# Altium project TS_24 PDM_2.PrjPcb
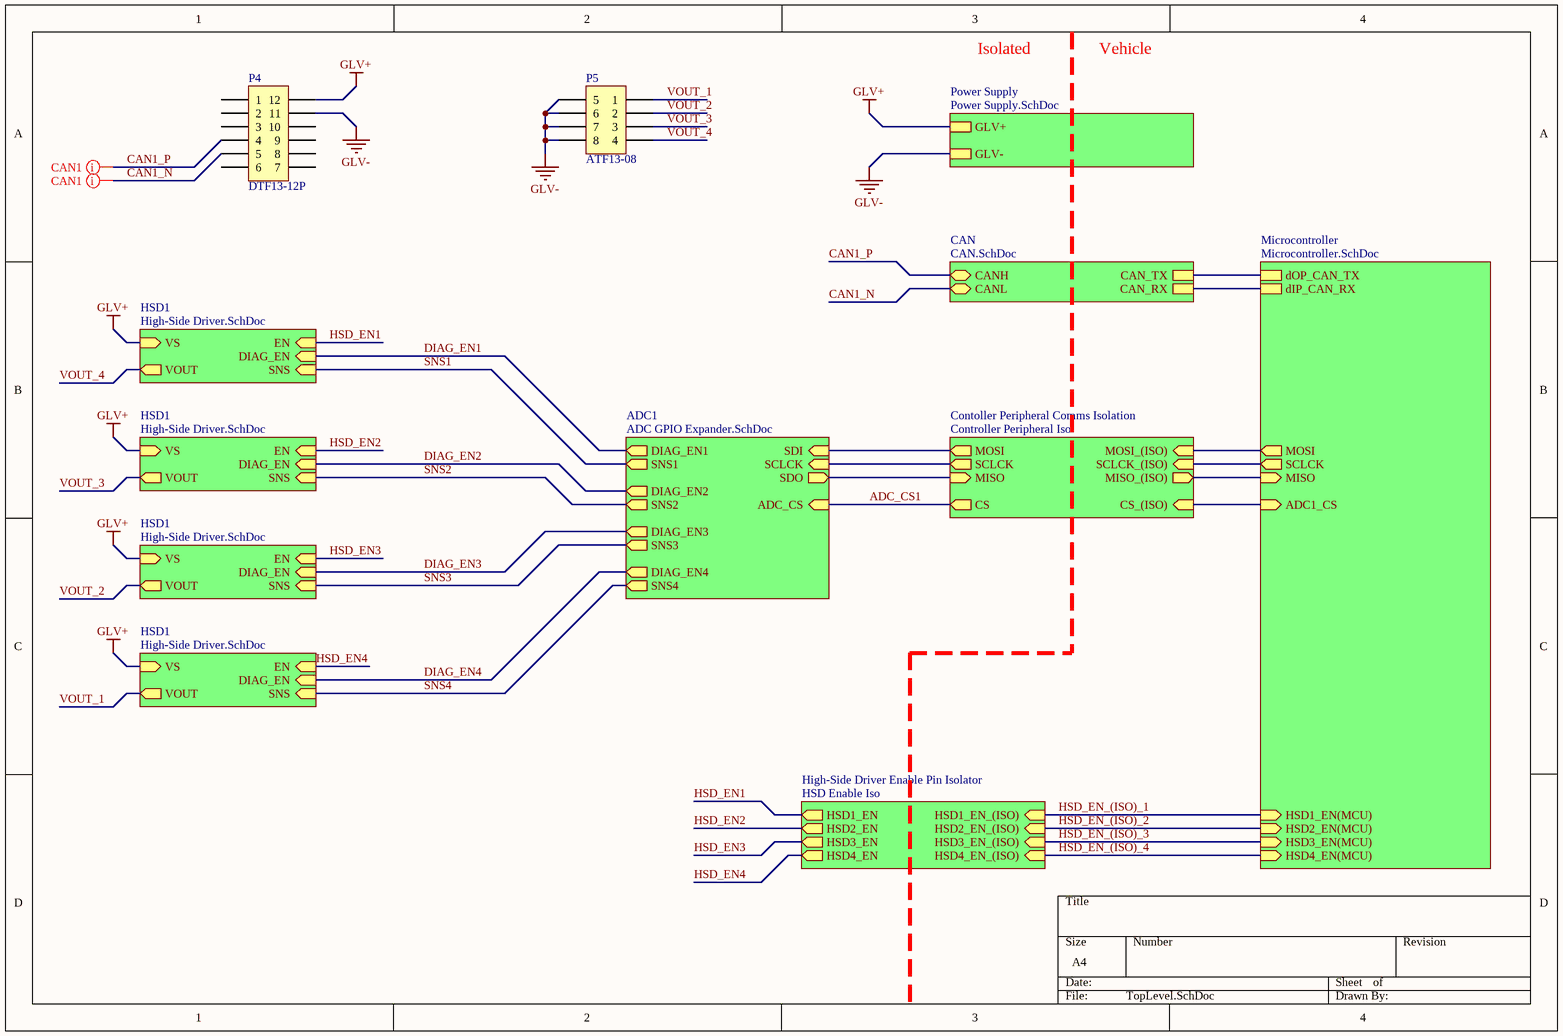
[diagram p0: TopLevel.SchDoc]
6 sheets, 108 parts. Net scope: hierarchical (ports join the sheet entries above them; power ports are global).
Board file: PCB.PcbDoc
Sheets:
  TopLevel.SchDoc
    Power Supply = Power Supply.SchDoc
    Contoller Peripheral Comms Isolation = Controller Peripheral Iso.SchDoc
    Microcontroller = Microcontroller.SchDoc
    HSD1 = High-Side Driver.SchDoc
    HSD1 = High-Side Driver.SchDoc
    HSD1 = High-Side Driver.SchDoc
    HSD1 = High-Side Driver.SchDoc
    ADC1 = ADC GPIO Expander.SchDoc

## Sheet TopLevel.SchDoc
size A4; SheetNumber: 1; SheetTotal: 8

### Parts
P4  DTF13-12P  [DTF13-12P]
P5  ATF13-08  [ATF13-08]

### Sub-sheets
ADC1 = ADC GPIO Expander.SchDoc: SDO (out), SCLCK (in), SDI (in), ADC_CS (in), DIAG_EN1 (out), SNS1 (out), DIAG_EN2 (out), SNS2 (out), DIAG_EN3 (out), SNS3 (out), DIAG_EN4 (out), SNS4 (out)
CAN = CAN.SchDoc (file not in this document): CANH (bidir), CANL (bidir), CAN_TX, CAN_RX
Contoller Peripheral Comms Isolation = Controller Peripheral Iso: MOSI (out), SCLCK (out), MISO (in), MOSI_(ISO) (in), MISO_(ISO) (out), SCLCK_(ISO) (in), CS (out), CS_(ISO) (in)
High-Side Driver Enable Pin Isolator = HSD Enable Iso (file not in this document): HSD1_EN (out), HSD2_EN (out), HSD3_EN (out), HSD1_EN_(ISO) (in), HSD3_EN_(ISO) (in), HSD2_EN_(ISO) (in), HSD4_EN (out), HSD4_EN_(ISO) (in)
HSD1 = High-Side Driver.SchDoc: VS (in), EN (in), DIAG_EN (in), SNS (in), VOUT (out)
HSD1 = High-Side Driver.SchDoc: VS (in), EN (in), DIAG_EN (in), SNS (in), VOUT (out)
HSD1 = High-Side Driver.SchDoc: VS (in), EN (in), DIAG_EN (in), SNS (in), VOUT (out)
HSD1 = High-Side Driver.SchDoc: VS (in), EN (in), DIAG_EN (in), SNS (in), VOUT (out)
Microcontroller = Microcontroller.SchDoc: dOP_CAN_TX, dIP_CAN_RX, MOSI (out), MISO (in), SCLCK (out), HSD1_EN(MCU) (in), HSD2_EN(MCU) (in), HSD3_EN(MCU) (in), HSD4_EN(MCU) (in), ADC1_CS (in)
Power Supply = Power Supply.SchDoc: GLV+, GLV-

### Nets
GLV+: P4.12 ; sheet Power Supply/GLV+, sheet HSD1/VS, sheet HSD1/VS, sheet HSD1/VS, sheet HSD1/VS
GLV-: P4.11 P5.5 P5.6 P5.7 P5.8 ; sheet Power Supply/GLV-
ADC_CS1: sheet Contoller Peripheral Comms Isolation/CS, sheet ADC1/ADC_CS  [project net ADC_CS]
CAN1_N: P4.5 ; sheet CAN/CANL
CAN1_P: P4.4 ; sheet CAN/CANH
DIAG_EN1: sheet HSD1/DIAG_EN, sheet ADC1/DIAG_EN1
DIAG_EN2: sheet HSD1/DIAG_EN, sheet ADC1/DIAG_EN2
DIAG_EN3: sheet HSD1/DIAG_EN, sheet ADC1/DIAG_EN3
DIAG_EN4: sheet HSD1/DIAG_EN, sheet ADC1/DIAG_EN4
HSD_EN1: sheet High-Side Driver Enable Pin Isolator/HSD1_EN, sheet HSD1/EN
HSD_EN2: sheet High-Side Driver Enable Pin Isolator/HSD2_EN, sheet HSD1/EN
HSD_EN3: sheet High-Side Driver Enable Pin Isolator/HSD3_EN, sheet HSD1/EN
HSD_EN4: sheet High-Side Driver Enable Pin Isolator/HSD4_EN, sheet HSD1/EN
HSD_EN_(ISO)_1: sheet High-Side Driver Enable Pin Isolator/HSD1_EN_(ISO), sheet Microcontroller/HSD1_EN(MCU)
HSD_EN_(ISO)_2: sheet High-Side Driver Enable Pin Isolator/HSD2_EN_(ISO), sheet Microcontroller/HSD2_EN(MCU)
HSD_EN_(ISO)_3: sheet High-Side Driver Enable Pin Isolator/HSD3_EN_(ISO), sheet Microcontroller/HSD3_EN(MCU)
HSD_EN_(ISO)_4: sheet High-Side Driver Enable Pin Isolator/HSD4_EN_(ISO), sheet Microcontroller/HSD4_EN(MCU)
SCLCK: sheet Contoller Peripheral Comms Isolation/SCLCK, sheet ADC1/SCLCK
SDI: sheet Contoller Peripheral Comms Isolation/MOSI, sheet ADC1/SDI
SDO: sheet Contoller Peripheral Comms Isolation/MISO, sheet ADC1/SDO
SNS1: sheet HSD1/SNS, sheet ADC1/SNS1
SNS2: sheet HSD1/SNS, sheet ADC1/SNS2
SNS3: sheet HSD1/SNS, sheet ADC1/SNS3
SNS4: sheet HSD1/SNS, sheet ADC1/SNS4
VOUT_1: P5.1 ; sheet HSD1/VOUT
VOUT_2: P5.2 ; sheet HSD1/VOUT
VOUT_3: P5.3 ; sheet HSD1/VOUT
VOUT_4: P5.4 ; sheet HSD1/VOUT
NetISO1_3: sheet Contoller Peripheral Comms Isolation/CS_(ISO), sheet Microcontroller/ADC1_CS
NetISO1_4: sheet Contoller Peripheral Comms Isolation/MISO_(ISO), sheet Microcontroller/MISO
NetISO1_5: sheet Contoller Peripheral Comms Isolation/SCLCK_(ISO), sheet Microcontroller/SCLCK
NetISO1_6: sheet Contoller Peripheral Comms Isolation/MOSI_(ISO), sheet Microcontroller/MOSI
NetR12_1: sheet CAN/CAN_RX, sheet Microcontroller/dIP_CAN_RX
NetR13_1: sheet CAN/CAN_TX, sheet Microcontroller/dOP_CAN_TX

Not connected (* = marked no-connect by the designer): P4 1 2 3 6 7 8 9 10

### Layout directives
differential pair: CAN1_N, CAN1_P

### Notes on the sheet
- Isolated
- Vehicle

### Library data of the parts
P4 = DTF13-12P: Positions: 12; Pitch: 4.45mm; Angle: 90; Flange: No; Contact: Copper Alloy; Part Number: DTF13-12P; Row Spacing: 4.45mm; Digikey Part Number: 1734-1861-ND; Digikey Link: https://www.digikey.com/products/en?keywords=dtf13-12pa
P5 = ATF13-08: Part Number: ATF13-08

## Sheet Power Supply.SchDoc
size A4; SheetNumber: 8; SheetTotal: 8
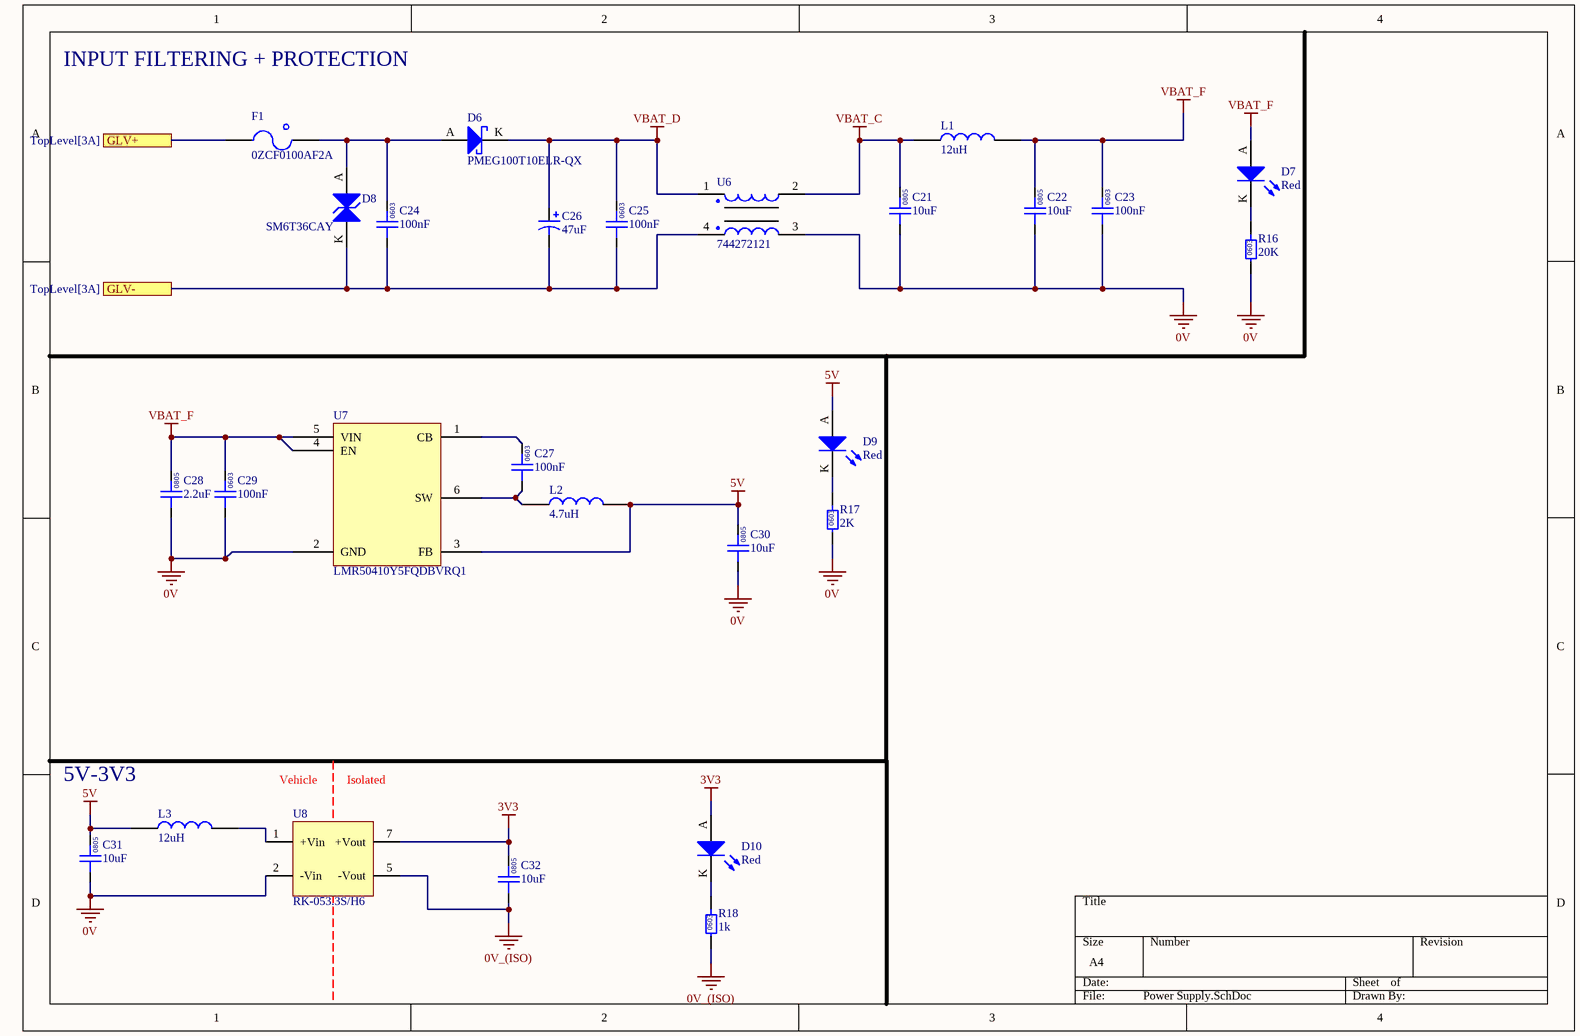
[diagram p1: Power Supply.SchDoc]

### Parts
C21  10uF  [0805]
C22  10uF  [0805]
C23  100nF  [0603]
C24  100nF  [0603]
C25  100nF  [0603]
C26  47uF  [CHEMI-CON ELCO]
C27  100nF  [0603]
C28  2.2uF  [0805]
C29  100nF  [0603]
C30  10uF  [0805]
C31  10uF  [0805]
C32  10uF  [0805]
D6  PMEG100T10ELR-QX  [NXP SOD123W]
D7  Red  [0805 LED]
D8  SM6T36CAY  [ST SMB DIODE]
D9  Red  [0805 LED]
D10  Red  [0805 LED]
F1  0ZCF0100AF2A  [2920]
L1  12uH  [1812]
L2  4.7uH  [SRN3015TA-4R7M]
L3  12uH  [1812]
R16  20K  [0603]
R17  2K  [0603]
R18  1k  [0603]
U6  744272121  [Wurth 4-PC Pad]
U7  LMR50410Y5FQDBVRQ1  [TI-SOT23-6]
U8  RK-053.3S/H6  [RK-053.3S/H6]

### Ports
GLV+ (see TopLevel[3A]), GLV- (see TopLevel[3A])

### Nets
0V: C21.1 C22.1 C23.1 C28.1 C29.1 C30.1 C31.1 R16.1 R17.1 U6.3 U7.2(GND) U8.2(-Vin)
0V_(ISO): C32.1 R18.1 U8.5(-Vout)
3V3: C32.2 D10.A U8.7(+Vout)
5V: C30.2 C31.2 D9.A L2.1 L3.2 U7.3(FB)
GLV+: F1.1 ; port GLV+
GLV-: C24.1 C25.1 C26.1 D8.K U6.4 ; port GLV-
VBAT_C: C21.2 L1.2 U6.2
VBAT_D: C25.2 C26.2 D6.K U6.1
VBAT_F: C22.2 C23.2 C28.2 C29.2 D7.A L1.1 U7.4(EN) U7.5(VIN)
NetC24_2: C24.2 D6.A D8.A F1.2
NetC27_1: C27.1 L2.2 U7.6(SW)
NetC27_2: C27.2 U7.1(CB)
NetD7_K: D7.K R16.2
NetD9_K: D9.K R17.2
NetD10_K: D10.K R18.2
NetL3_1: L3.1 U8.1(+Vin)

### Notes on the sheet
- INPUT FILTERING + PROTECTION
- 5V-3V3
- Vehicle
- Isolated
- (in symbol GCM188L81H104KA57D) 0603
- (in symbol GRM21BR6YA106KE43L) 0805
- (in symbol GRM21BR71E225KE11L) 0805
- (in symbol RC0603FR-071KL) 0603
- (in symbol RC0603FR-072KL) 0603
- (in symbol RC0603FR-0720KL) 0603

### Library data of the parts
C21 C22 C30-C32 = GRM21BR6YA106KE43L: Manufacturer: muRata; Rated Voltage: 50V; Tolerance: 10%; Material: MLCC; Temperature Rating: X5R; Part Number: GRM21BR6YA106KE43L; Value: 10uF; Digikey Part Number: 490-10514-6-ND
C23-C25 C27 C29 = GCM188L81H104KA57D: Manufacturer: muRata; Rated Voltage: 50V; Tolerance: ±10%; Material: MLCC; Temperature Rating: X8L; Part Number: GCM188L81H104KA57D; Value: 100nF; Digikey Part Number: 490-6049-1-ND
C26 = HHXA350ARA470MF61G: Part Number: HHXA350ARA470MF61G
C28 = GRM21BR71E225KE11L: Manufacturer: Murata Electronics; Rated Voltage: 25V; Tolerance: ±10%; Material: MLCC; Temperature Rating: X7R; Part Number: GRM21BR71E225KE11L; Value: 2.2uF; Digikey Part Number: 490-14467-2-ND
D6 = PMEG100T10ELR-QX: Manufacturer: Nexperia USA Inc.; Forward Voltage: 0.75 V @ 1A; Breakdown Voltage: 100 V; Rated Power: 680 mW; Part Number: PMEG100T10ELR-QX; Digikey Part Number: 1727-PMEG100T10ELR-QXCT-ND
D7 D9 D10 = SML-210LTT86: Red LED Indication - Discrete 1.75V 0805 (2012 Metric); Manufacturer: ROHM Semiconductor; Part Number: SML-210LTT86; Colour: Red; Digikey Part Number: 511-1286-1-ND
D8 = SM6T36CAY: Manufacturer: STMicroelectronics; Forward Voltage: 30.8 V; Rated Power: 600W; Part Number: SM6T36CAY; Breakdown Voltage: 30.8 V; Digikey Part Number: 497-10804-1-ND
F1 = 0ZCF0100AF2A: PTC RESET FUSE 60V 1A 292; Manufacturer: Littelfuse Inc.; Part Number: 0ZCF0100AF2A; Digikey Part Number: 507-2070-1-ND; Digikey Link: https://www.digikey.com/product-detail/en/bel-fuse-inc/0ZCF0100AF2A/507-2070-1-ND/6210547
L1 L3 = RLS-126: Manufacturer: Recom; Tolerance: 0.2; Impedance: 230mOhm; Rated Current: 0.8 A; Material: Wirewound; Part Number: RLS-126; Value: 12uH; Digikey Part Number: 945-3429-ND
L2 = SRN4018-4R7M: Manufacturer: Bourns; Tolerance: 0.2; Impedance: 84mOhms; Rated Current: 1.9A; Material: Wirewound; Part Number: SRN4018-4R7M; Value: 4.7uH; Digikey Part Number: SRN3015TA-4R7MCT-ND
R16 = RC0603FR-0720KL: Manufacturer: YAGEO; Tolerance: 0.01; Rated Power: 0.1W; Part Number: RC0603FR-0720KL; Value: 20K; Digikey Part Number: 311-20.0KHRCT-ND; Material: FR-07
R17 = RC0603FR-072KL: Manufacturer: YAGEO; Tolerance: 0.01; Rated Power: 0.1W; Part Number: RC0603FR-072KL; Value: 2K; Digikey Part Number: 311-2.00KHRCT-ND; Material: FR-07
R18 = RC0603FR-071KL: Manufacturer: YAGEO; Tolerance: 0.01; Rated Power: 0.1W; Part Number: RC0603FR-071KL; Value: 1k; Digikey Part Number: 311-1.00KHRCT-ND; Material: FR-07
U6 = 744272121: Manufacturer: Wurth Electronics Inc; Value: 120uH @ 100kHz; Impedance: 460 Ohms @ 30MHz; Rated Current: 2.5 A; Part Number: 744272121; Material: Wirewound; Digikey Part Number: 732-1489-1-ND
U7 = LMR50410-Q1: IC REG BUCK 5V 1A SOT23-6; Manufacturer: Texas Instruments; Input Voltage: 4-36V; Part Number: LMR50410-Q1; Output Voltage: 5V; Output Current: 1A; Digikey Part Number: 296-LMR50410Y5FQDBVRQ1CT-ND
U8 = RK-053.3S/H6: DC DC CONVERTER 3.3V 1W; Manufacturer: Recom; Input Voltage: 5V; Output Current: 303mA; Part Number: RK-053.3S/H6; Output Voltage: 3.3V

## Sheet Controller Peripheral Iso.SchDoc
size A4; SheetNumber: 4; SheetTotal: 8
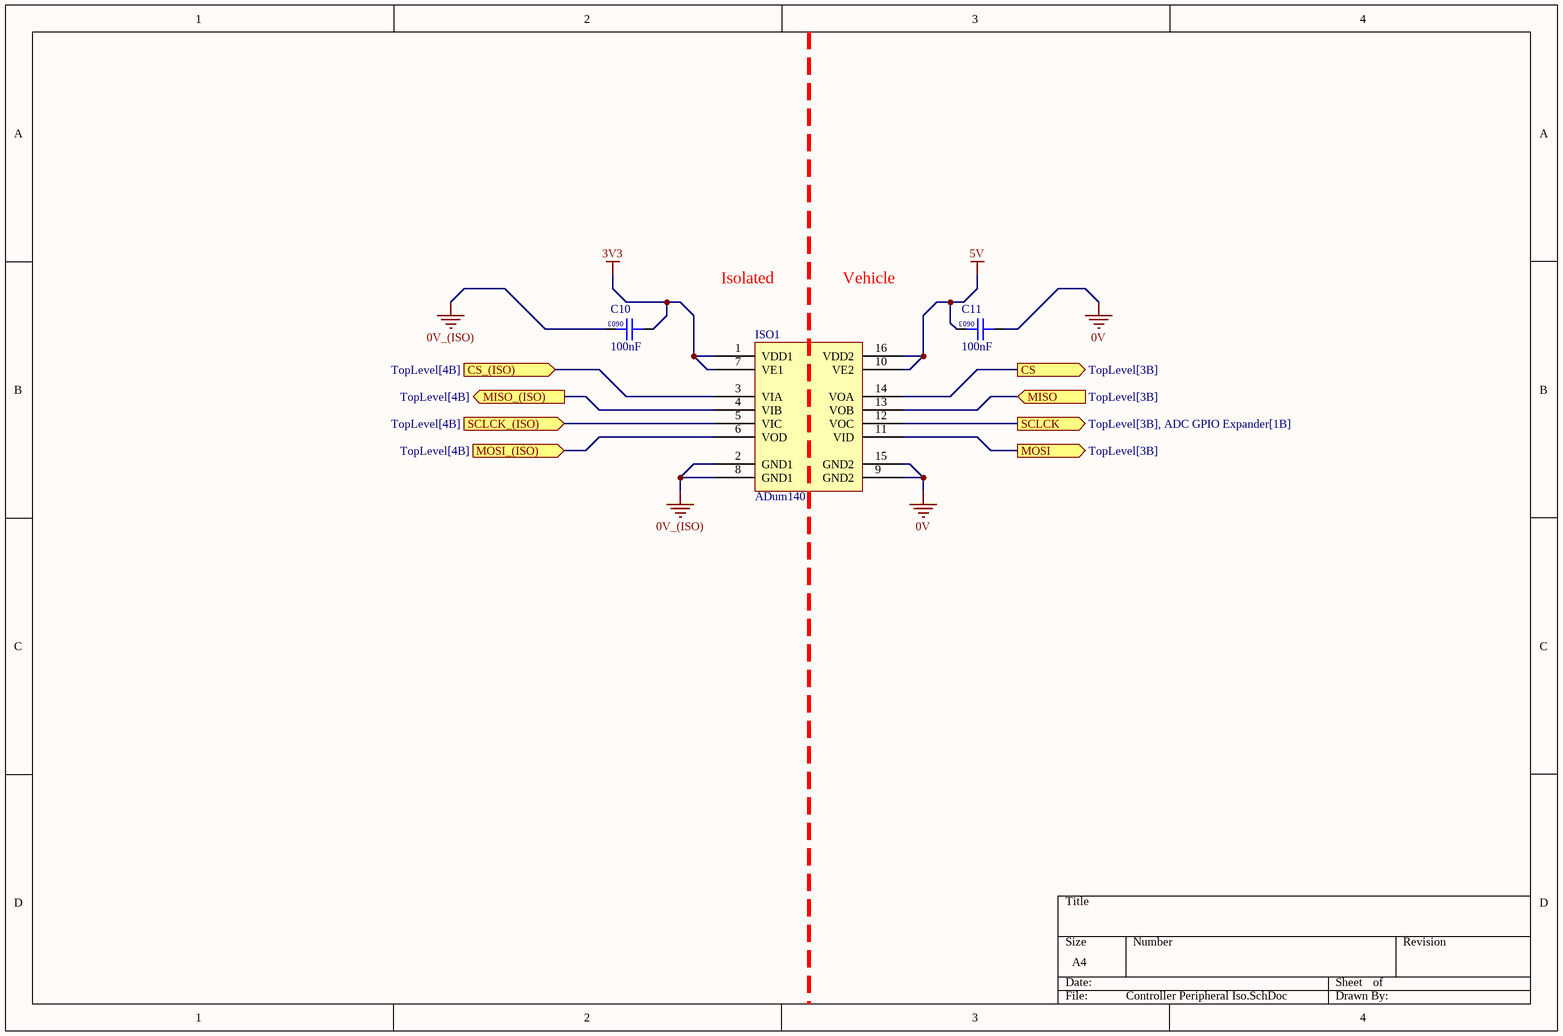
[diagram p2: Controller Peripheral Iso.SchDoc]

### Parts
C10  100nF  [0603]
C11  100nF  [0603]
ISO1  ADum1401  [AD 16-SOIC]

### Ports
CS (out, see TopLevel[3B]), CS_(ISO) (in, see TopLevel[4B]), MISO (in, see TopLevel[3B]), MISO_(ISO) (out, see TopLevel[4B]), MOSI (out, see TopLevel[3B]), MOSI_(ISO) (in, see TopLevel[4B]), SCLCK (out, see TopLevel[3B], ADC GPIO Expander[1B]), SCLCK_(ISO) (in, see TopLevel[4B])

### Nets
0V: C11.1 ISO1.9(GND2) ISO1.15(GND2)
0V_(ISO): C10.2 ISO1.2(GND1) ISO1.8(GND1)
3V3: C10.1 ISO1.1(VDD1) ISO1.7(VE1)
5V: C11.2 ISO1.10(VE2) ISO1.16(VDD2)
ADC_CS: ISO1.14(VOA) ; port CS
SCLCK: ISO1.12(VOC) ; port SCLCK
SDI: ISO1.11(VID) ; port MOSI
SDO: ISO1.13(VOB) ; port MISO
NetISO1_3: ISO1.3(VIA) ; port CS_(ISO)
NetISO1_4: ISO1.4(VIB) ; port MISO_(ISO)
NetISO1_5: ISO1.5(VIC) ; port SCLCK_(ISO)
NetISO1_6: ISO1.6(VOD) ; port MOSI_(ISO)

### Notes on the sheet
- Isolated
- Vehicle
- (in symbol GCM188L81H104KA57D) 0603

### Library data of the parts
C10 C11 = GCM188L81H104KA57D: as C23 on sheet Power Supply; Part Number: GCM188L81H104KA57D; Value: 100nF; Digikey Part Number: 490-6049-1-ND
ISO1 = ADuM1401: General Purpose Digital Isolator 2500Vrms 4 Channel 1Mbps 25kV/µs CMTI 16-SOIC (0.295", 7.50mm Width); Manufacturer: Analog Devices; Complex IC: 0; Part Number: ADuM1401

## Sheet Microcontroller.SchDoc
size A4; SheetNumber: 7; SheetTotal: 8
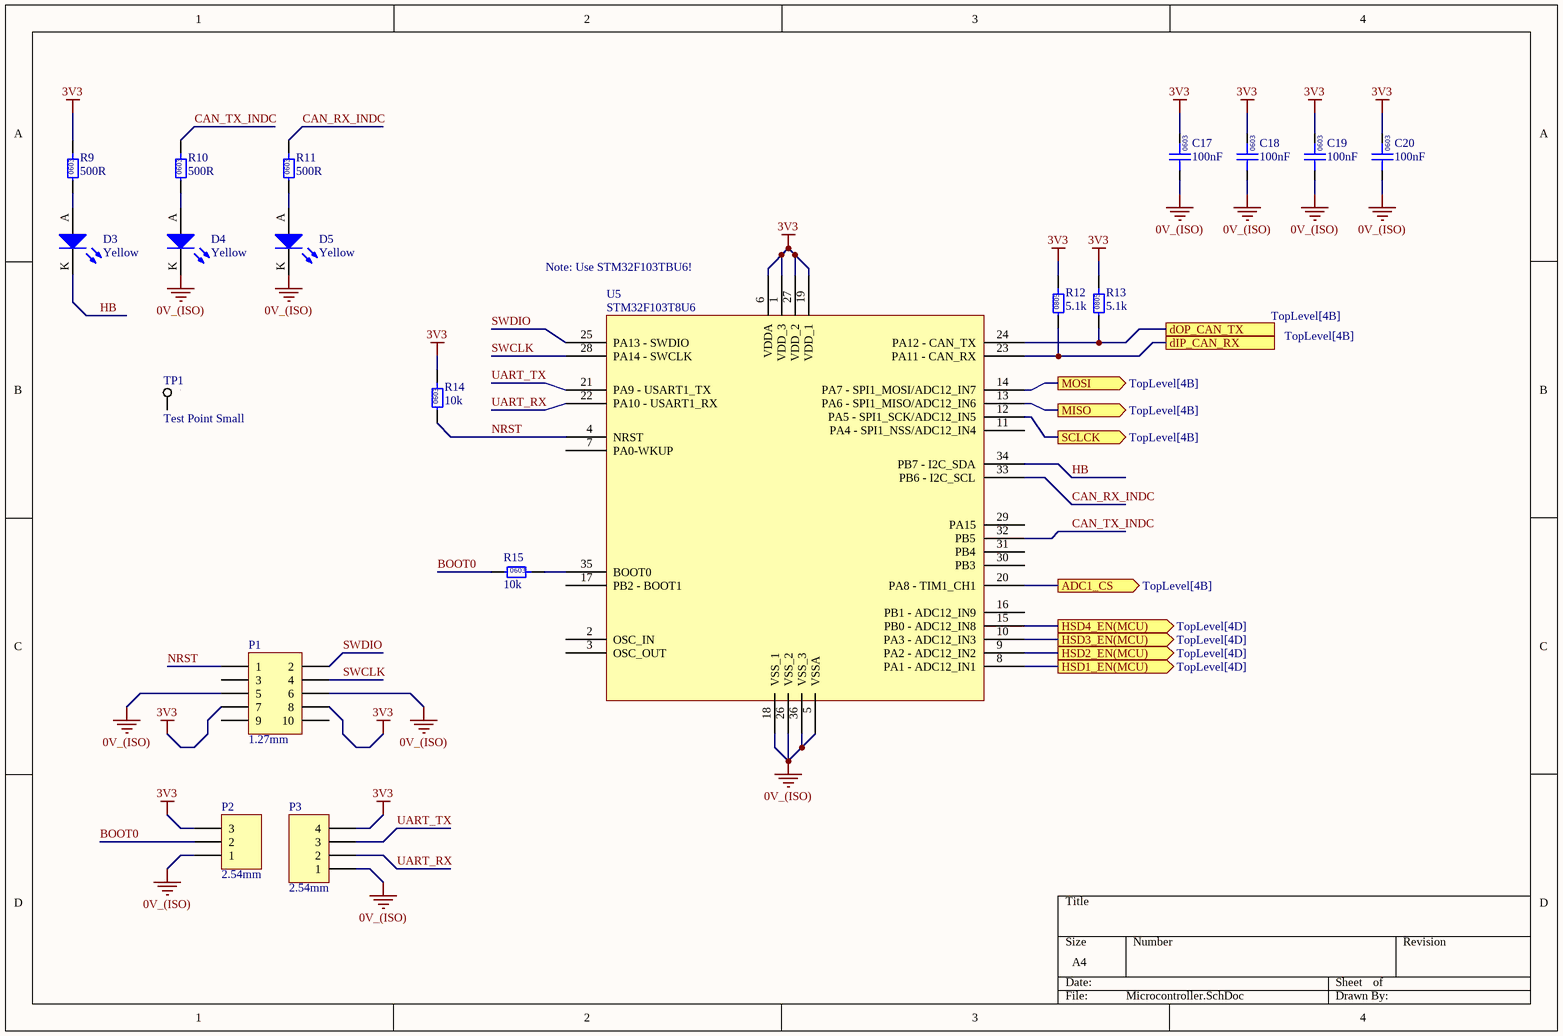
[diagram p3: Microcontroller.SchDoc]

### Parts
C17  100nF  [0603]
C18  100nF  [0603]
C19  100nF  [0603]
C20  100nF  [0603]
D3  Yellow  [0805 LED]
D4  Yellow  [0805 LED]
D5  Yellow  [0805 LED]
P1  1.27mm  [3221-10-0300-00]
P2  2.54mm  [TH 2.54mm Header 1x3]
P3  2.54mm  [TH 2.54mm Header 1x4]
R9  500R  [0603]
R10  500R  [0603]
R11  500R  [0603]
R12  5.1k  [0805]
R13  5.1k  [0805]
R14  10k  [0603]
R15  10k  [0603]
TP1  Test Point Small  [SMD Test Point 1mm]
U5  STM32F103T8U6  [STM_QFN-36]

### Ports
ADC1_CS (out, see TopLevel[4B]), dIP_CAN_RX (see TopLevel[4B]), dOP_CAN_TX (see TopLevel[4B]), HSD1_EN(MCU) (out, see TopLevel[4D]), HSD2_EN(MCU) (out, see TopLevel[4D]), HSD3_EN(MCU) (out, see TopLevel[4D]), HSD4_EN(MCU) (out, see TopLevel[4D]), MISO (out, see TopLevel[4B]), MOSI (out, see TopLevel[4B]), SCLCK (out, see TopLevel[4B])

### Nets
0V_(ISO): C17.1 C18.1 C19.1 C20.1 D4.K D5.K P1.5 P1.6 P2.1 P3.1 U5.5(VSSA) U5.18(VSS_1) U5.26(VSS_2) U5.36(VSS_3)
3V3: C17.2 C18.2 C19.2 C20.2 P1.7 P1.8 P2.3 P3.4 R9.2 R12.2 R13.2 R14.2 U5.1(VDD_3) U5.6(VDDA) U5.19(VDD_1) U5.27(VDD_2)
BOOT0: P2.2 R15.1
CAN_RX_INDC: R11.2 U5.33(PB6_-_I2C_SCL)
CAN_TX_INDC: R10.2 U5.32(PB5)
HB: D3.K U5.34(PB7_-_I2C_SDA)
HSD_EN_(ISO)_1: U5.8(PA1_-_ADC12_IN1) ; port HSD1_EN(MCU)
HSD_EN_(ISO)_2: U5.9(PA2_-_ADC12_IN2) ; port HSD2_EN(MCU)
HSD_EN_(ISO)_3: U5.10(PA3_-_ADC12_IN3) ; port HSD3_EN(MCU)
HSD_EN_(ISO)_4: U5.15(PB0_-_ADC12_IN8) ; port HSD4_EN(MCU)
NRST: P1.1 R14.1 U5.4(NRST)
SWCLK: P1.4 U5.28(PA14_-_SWCLK)
SWDIO: P1.2 U5.25(PA13_-_SWDIO)
UART_RX: P3.2 U5.22(PA10_-_USART1_RX)
UART_TX: P3.3 U5.21(PA9_-_USART1_TX)
NetD3_A: D3.A R9.1
NetD4_A: D4.A R10.1
NetD5_A: D5.A R11.1
NetISO1_3: U5.20(PA8_-_TIM1_CH1) ; port ADC1_CS
NetISO1_4: U5.13(PA6_-_SPI1_MISO/ADC12_IN6) ; port MISO
NetISO1_5: U5.12(PA5_-_SPI1_SCK/ADC12_IN5) ; port SCLCK
NetISO1_6: U5.14(PA7_-_SPI1_MOSI/ADC12_IN7) ; port MOSI
NetR12_1: R12.1 U5.23(PA11_-_CAN_RX) ; port dIP_CAN_RX
NetR13_1: R13.1 U5.24(PA12_-_CAN_TX) ; port dOP_CAN_TX
NetR15_2: R15.2 U5.35(BOOT0)

Not connected (* = marked no-connect by the designer): P1 3 9 10; TP1 1; U5 2(OSC_IN) 3(OSC_OUT) 7(PA0-WKUP) 11(PA4_-_SPI1_NSS/ADC12_IN4) 16(PB1_-_ADC12_IN9) 17(PB2_-_BOOT1_) 29(PA15) 30(PB3) 31(PB4)

### Notes on the sheet
- (near U5) Note: Use STM32F103TBU6!
- (in symbol GCM188L81H104KA57D) 0603
- (in symbol RC0603FR-0710KL) 0603
- (in symbol RC0805FR075K1L) 0805
- (in symbol RT0603BRD07500RL) 0603

### Library data of the parts
C17-C20 = GCM188L81H104KA57D: as C23 on sheet Power Supply; Part Number: GCM188L81H104KA57D; Value: 100nF; Digikey Part Number: 490-6049-1-ND
D3-D5 = SML-211YTT86: Yellow LED Indication - Discrete 1.75V 0805 (2012 Metric); Manufacturer: ROHM Semiconductor; Part Number: SML-211YTT86; Colour: Yellow; Digikey Part Number: 511-1293-1-ND
P1 = SMD 1.27mm Header 2x5 (3221-10-0300-00): Positions: 10; Angle: 0; Flange: No; Contact: NA; Part Number: SMD 1.27mm Header 2x5 (3221-10-0300-00); Pitch: 1.27mm; Row Spacing: 1.27mm
P2 = TH 2.54mm Header 1x3: Positions: 3; Angle: 0; Flange: No; Contact: NA; Part Number: TH 2.54mm Header 1x3; Pitch: 2.54mm; Row Spacing: 2.54mm
P3 = TH 2.54mm Header 1x4: Positions: 4; Angle: 0; Flange: No; Contact: NA; Part Number: TH 2.54mm Header 1x4; Pitch: 2.54mm; Row Spacing: 2.54mm
R9-R11 = RT0603BRD07500RL: Manufacturer: YAGEO; Tolerance: 0.01; Rated Power: 0.1W; Part Number: RT0603BRD07500RL; Value: 500R; Material: FR-07; Digikey Part Number: 13-RT0603BRD07500RL-ND
R12 R13 = RC0805FR075K1L: Manufacturer: YAGEO; Tolerance: 0.01; Rated Power: 0.125W; Part Number: RC0805FR075K1L; Value: 5.1k; Material: FR-07; Digikey Part Number: 311-5.10KCRCT-ND
R14 R15 = RC0603FR-0710KL: Manufacturer: YAGEO; Tolerance: 0.01; Rated Power: 0.1W; Part Number: RC0603FR-0710KL; Value: 10k; Digikey Part Number: 311-10.0KHRCT-ND; Material: FR-07
TP1 = SMD Test Point Small: Positions: 1; Pitch: 0mm; Row Spacing: 0; Flange: No; Contact: NA; Part Number: SMD Test Point Small; Angle: 0
U5 = STM32F103T8U6: ARM® Cortex®-M3 STM32F1 Microcontroller IC 32-Bit 72MHz 64KB (64K x 8) FLASH QFN; Manufacturer: ST Microelectronics; Part Number: STM32F103T8U6; Digikey Part Number: STM32F103T8U6; Digikey Link: https://www.digikey.com/en/products/detail/stmicroelectronics/stm32f103t8u6/1852493

## Sheet High-Side Driver.SchDoc
size A4; SheetNumber: 8; SheetTotal: 9
Used 4 times, as channels HSD1, HSD1, HSD1, HSD1. Parts and nets are listed once, with the designators drawn on the sheet.
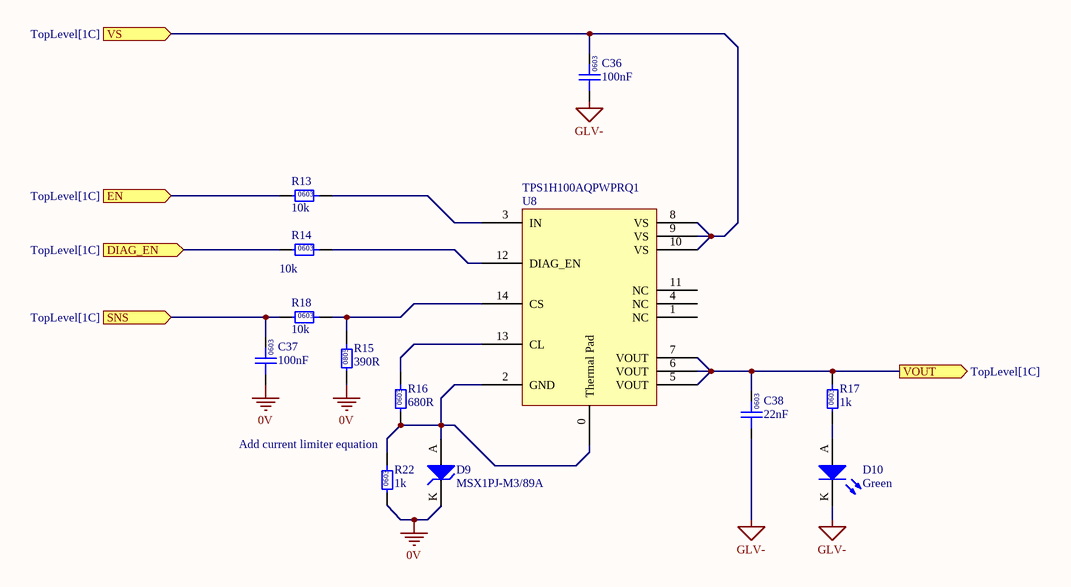
[diagram p4: High-Side Driver.SchDoc]

### Parts
C36  100nF  [0603]
C37  100nF  [0603]
C38  22nF  [0603]
D9  MSX1PJ-M3/89A  [VISHAY DO-219]
D10  Green  [0805 LED]
R13  10k  [0603]
R14  10k  [0603]
R15  390R  [0805]
R16  680R  [0603]
R17  1k  [0603]
R18  10k  [0603]
R22  1k  [0603]
U8  TPS1H100AQPWPRQ1  [TI_14_TSSOP]

### Ports
DIAG_EN (in, see TopLevel[1C]), EN (in, see TopLevel[1C]), SNS (in, see TopLevel[1C]), VOUT (out, see TopLevel[1C]), VS (in, see TopLevel[1C])

### Nets
0V: C37.1 D9.K R15.1 R22.1
GLV-: C36.1 C38.1 D10.K
DIAG_EN: R14.1 ; port DIAG_EN
EN: R13.1 ; port EN
SNS: C37.2 R18.1 ; port SNS
VOUT: C38.2 R17.2 U8.5(VOUT) U8.6(VOUT) U8.7(VOUT) ; port VOUT
VS: C36.2 U8.8(VS) U8.9(VS) U8.10(VS) ; port VS
NetD9_A: D9.A R16.1 R22.2 U8.0(Thermal_Pad) U8.2(GND)
NetD10_A: D10.A R17.1
NetR13_2: R13.2 U8.3(IN)
NetR14_2: R14.2 U8.12(DIAG_EN)
NetR15_2: R15.2 R18.2 U8.14(CS)
NetR16_2: R16.2 U8.13(CL)

Not connected (* = marked no-connect by the designer): U8 1(NC) 4(NC) 11(NC)

### Channels
HSD1: designators C36=C12D C37=C13D C38=C14D D9=D1D D10=D2D R13=R2D R14=R3D R15=R5D R16=R6D R17=R7D R18=R4D R22=R8D U8=U4D; ports DIAG_EN=DIAG_EN1 EN=HSD_EN1 SNS=SNS1 VOUT=VOUT_4 VS=GLV+
HSD1: designators C36=C12C C37=C13C C38=C14C D9=D1C D10=D2C R13=R2C R14=R3C R15=R5C R16=R6C R17=R7C R18=R4C R22=R8C U8=U4C; ports DIAG_EN=DIAG_EN2 EN=HSD_EN2 SNS=SNS2 VOUT=VOUT_3 VS=GLV+
HSD1: designators C36=C12B C37=C13B C38=C14B D9=D1B D10=D2B R13=R2B R14=R3B R15=R5B R16=R6B R17=R7B R18=R4B R22=R8B U8=U4B; ports DIAG_EN=DIAG_EN3 EN=HSD_EN3 SNS=SNS3 VOUT=VOUT_2 VS=GLV+
HSD1: designators C36=C12A C37=C13A C38=C14A D9=D1A D10=D2A R13=R2A R14=R3A R15=R5A R16=R6A R17=R7A R18=R4A R22=R8A U8=U4A; ports DIAG_EN=DIAG_EN4 EN=HSD_EN4 SNS=SNS4 VOUT=VOUT_1 VS=GLV+

### Notes on the sheet
- (near R22) Add current limiter equation
- (in symbol GCM188L81H104KA57D) 0603
- (in symbol GCM188R71H223KA37J) 0603
- (in symbol RC0603FR-071KL) 0603
- (in symbol RC0603FR-0710KL) 0603
- (in symbol RC0603JR-13680RL) 0603
- (in symbol RC0805FR07390RL) 0805

### Library data of the parts
C36 C37 = GCM188L81H104KA57D: as C23 on sheet Power Supply; Part Number: GCM188L81H104KA57D; Value: 100nF; Digikey Part Number: 490-6049-1-ND
C38 = GCM188R71H223KA37J: Manufacturer: Murata Electronics; Rated Voltage: 50V; Tolerance: ±10%; Material: MLCC; Temperature Rating: X7R; Part Number: GCM188R71H223KA37J; Value: 22nF; Digikey Part Number: 490-8022-2-ND
D9 = MSX1PJ-M3/89A: Manufacturer: Vishay General Semiconductor - Diodes Division; Breakdown Voltage: 600V; Part Number: MSX1PJ-M3/89A
D10 = SML-210FTT86: Green LED Indication - Discrete 1.75V 0805 (2012 Metric); Manufacturer: ROHM Semiconductor; Part Number: SML-210FTT86; Colour: Green; Digikey Part Number: 511-1285-1-ND
R13 R14 R18 = RC0603FR-0710KL: as R14 on sheet Microcontroller; Part Number: RC0603FR-0710KL; Value: 10k; Material: FR-07; Digikey Part Number: 311-10.0KHRCT-ND
R15 = RC0805FR07390RL: Manufacturer: YAGEO; Tolerance: 0.01; Rated Power: 0.125W; Part Number: RC0805FR07390RL; Value: 390R; Material: FR-07; Digikey Part Number: 311-390CRCT-ND
R16 = RC0603JR-13680RL: Manufacturer: YAGEO; Tolerance: 0.01; Rated Power: 0.1W; Part Number: RC0603JR-13680RL; Value: 680R; Material: FR-07; Digikey Part Number: 13-RC0603JR-13680RLCT-ND
R17 R22 = RC0603FR-071KL: as R18 on sheet Power Supply; Part Number: RC0603FR-071KL; Value: 1k; Material: FR-07; Digikey Part Number: 311-1.00KHRCT-ND
U8 = TPS1H100AQPWPRQ1: IC PWR SWTCH N-CHAN 1:1 14HTSSOP; Manufacturer: Texas Instruments; Complex IC: 1; Part Number: TPS1H100AQPWPRQ1

## Sheet ADC GPIO Expander.SchDoc
size A4; SheetNumber: 2; SheetTotal: 8
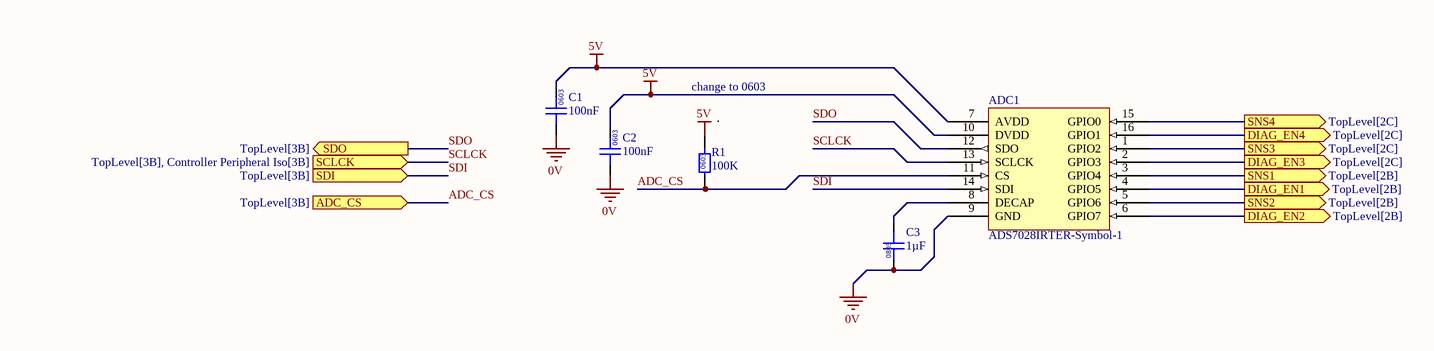
[diagram p5: ADC GPIO Expander.SchDoc]

### Parts
ADC1  ADS7028IRTER-Symbol-1  [WFQN-16]
C1  100nF  [0603]
C2  100nF  [0603]
C3  1µF  [0805]
R1  100K  [0603]

### Ports
ADC_CS (in, see TopLevel[3B]), DIAG_EN1 (out, see TopLevel[2B]), DIAG_EN2 (out, see TopLevel[2B]), DIAG_EN3 (out, see TopLevel[2C]), DIAG_EN4 (out, see TopLevel[2C]), SCLCK (in, see TopLevel[3B], Controller Peripheral Iso[3B]), SDI (in, see TopLevel[3B]), SDO (out, see TopLevel[3B]), SNS1 (out, see TopLevel[2B]), SNS2 (out, see TopLevel[2B]), SNS3 (out, see TopLevel[2C]), SNS4 (out, see TopLevel[2C])

### Nets
0V: ADC1.9(GND) C1.1 C2.1 C3.1
5V: ADC1.7(AVDD) ADC1.10(DVDD) C1.2 C2.2 R1.2
ADC_CS: ADC1.11(CS) R1.1 ; port ADC_CS
DIAG_EN1: ADC1.4(GPIO5) ; port DIAG_EN1
DIAG_EN2: ADC1.6(GPIO7) ; port DIAG_EN2
DIAG_EN3: ADC1.2(GPIO3) ; port DIAG_EN3
DIAG_EN4: ADC1.16(GPIO1) ; port DIAG_EN4
SCLCK: ADC1.13(SCLCK) ; port SCLCK
SDI: ADC1.14(SDI) ; port SDI
SDO: ADC1.12(SDO) ; port SDO
SNS1: ADC1.3(GPIO4) ; port SNS1
SNS2: ADC1.5(GPIO6) ; port SNS2
SNS3: ADC1.1(GPIO2) ; port SNS3
SNS4: ADC1.15(GPIO0) ; port SNS4
NetADC1_8: ADC1.8(DECAP) C3.2

### Notes on the sheet
- change to 0603
- (in symbol GCM21BR71H105KA03L) 0805
- (in symbol GCM188L81H104KA57D) 0603
- (in symbol RC0603FR-07100KL) 0603

### Library data of the parts
ADC1 = ADS7028IRTER: IC ADC 12BIT SAR 16WQFN; Manufacturer: Texas Instruments; Complex IC: 1; Part Number: ADS7028IRTER; Digikey Part Number: ADS7028IRTER; Digikey Link: https://www.digikey.com.au/en/products/detail/texas-instruments/ADS7028IRTER/12696020?s=N4IgTCBcDaIIIBEDKB2ADGAHASQEoBUBRXEAXQF8g
C1 C2 = GCM188L81H104KA57D: as C23 on sheet Power Supply; Part Number: GCM188L81H104KA57D; Value: 100nF; Digikey Part Number: 490-6049-1-ND
C3 = GCM21BR71H105KA03L: Manufacturer: muRata; Rated Voltage: 50V; Tolerance: ±10%; Material: MLCC; Temperature Rating: X7R; Part Number: GCM21BR71H105KA03L; Value: 1µF; Digikey Part Number: 490-10675-1-ND
R1 = RC0603FR-07100KL: Manufacturer: YAGEO; Tolerance: 0.01; Rated Power: 0.1W; Part Number: RC0603FR-07100KL; Value: 100K; Material: FR-07

## Nets that join several sheets
0V: Power Supply (12 pins), Controller Peripheral Iso (C11.1 ISO1.9 ISO1.15), HSD1 (C13D.1 D1D.K R5D.1 R8D.1), HSD1 (C13C.1 D1C.K R5C.1 R8C.1), HSD1 (C13B.1 D1B.K R5B.1 R8B.1), HSD1 (C13A.1 D1A.K R5A.1 R8A.1), ADC GPIO Expander (ADC1.9 C1.1 C2.1 C3.1)
0V_(ISO): Power Supply (C32.1 R18.1 U8.5), Controller Peripheral Iso (C10.2 ISO1.2 ISO1.8), Microcontroller (14 pins)
3V3: Power Supply (C32.2 D10.A U8.7), Controller Peripheral Iso (C10.1 ISO1.1 ISO1.7), Microcontroller (16 pins)
5V: Power Supply (6 pins), Controller Peripheral Iso (C11.2 ISO1.10 ISO1.16), ADC GPIO Expander (5 pins)
GLV+: TopLevel (P4.12), Power Supply (F1.1), HSD1 (C12D.2 U4D.8 U4D.9 U4D.10), HSD1 (C12C.2 U4C.8 U4C.9 U4C.10), HSD1 (C12B.2 U4B.8 U4B.9 U4B.10), HSD1 (C12A.2 U4A.8 U4A.9 U4A.10)
GLV-: TopLevel (5 pins), Power Supply (5 pins), HSD1 (C12D.1 C14D.1 D2D.K), HSD1 (C12C.1 C14C.1 D2C.K), HSD1 (C12B.1 C14B.1 D2B.K), HSD1 (C12A.1 C14A.1 D2A.K)
ADC_CS: Controller Peripheral Iso (ISO1.14), ADC GPIO Expander (ADC1.11 R1.1)
DIAG_EN1: HSD1 (R3D.1), ADC GPIO Expander (ADC1.4)
DIAG_EN2: HSD1 (R3C.1), ADC GPIO Expander (ADC1.6)
DIAG_EN3: HSD1 (R3B.1), ADC GPIO Expander (ADC1.2)
DIAG_EN4: HSD1 (R3A.1), ADC GPIO Expander (ADC1.16)
NetISO1_3: Controller Peripheral Iso (ISO1.3), Microcontroller (U5.20)
NetISO1_4: Controller Peripheral Iso (ISO1.4), Microcontroller (U5.13)
NetISO1_5: Controller Peripheral Iso (ISO1.5), Microcontroller (U5.12)
NetISO1_6: Controller Peripheral Iso (ISO1.6), Microcontroller (U5.14)
SCLCK: Controller Peripheral Iso (ISO1.12), ADC GPIO Expander (ADC1.13)
SDI: Controller Peripheral Iso (ISO1.11), ADC GPIO Expander (ADC1.14)
SDO: Controller Peripheral Iso (ISO1.13), ADC GPIO Expander (ADC1.12)
SNS1: HSD1 (C13D.2 R4D.1), ADC GPIO Expander (ADC1.3)
SNS2: HSD1 (C13C.2 R4C.1), ADC GPIO Expander (ADC1.5)
SNS3: HSD1 (C13B.2 R4B.1), ADC GPIO Expander (ADC1.1)
SNS4: HSD1 (C13A.2 R4A.1), ADC GPIO Expander (ADC1.15)
VOUT_1: TopLevel (P5.1), HSD1 (5 pins)
VOUT_2: TopLevel (P5.2), HSD1 (5 pins)
VOUT_3: TopLevel (P5.3), HSD1 (5 pins)
VOUT_4: TopLevel (P5.4), HSD1 (5 pins)